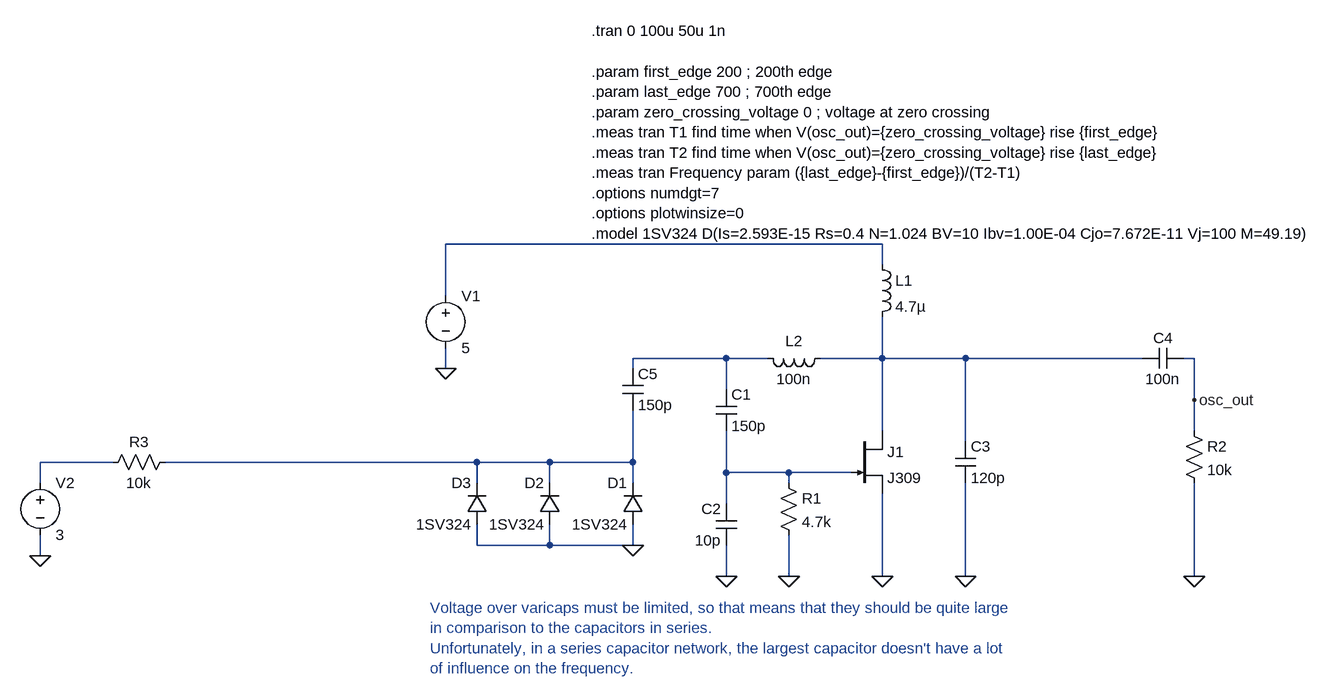
[diagram p0: schematic design5.asc]
design5.asc, the LTspice schematic file:
Version 4
SHEET 1 1480 680
WIRE 704 -32 32 -32
WIRE 704 0 704 -32
WIRE 32 48 32 -32
WIRE 464 144 320 144
WIRE 528 144 464 144
WIRE 704 144 704 80
WIRE 704 144 608 144
WIRE 832 144 704 144
WIRE 1104 144 832 144
WIRE 1184 144 1168 144
WIRE 32 160 32 128
WIRE 320 160 320 144
WIRE 464 192 464 144
WIRE 1184 208 1184 144
WIRE 704 256 704 144
WIRE 1184 256 1184 208
WIRE 832 272 832 144
WIRE -480 304 -592 304
WIRE 80 304 -400 304
WIRE 192 304 80 304
WIRE 320 304 320 224
WIRE 320 304 192 304
WIRE 464 320 464 256
WIRE 560 320 464 320
WIRE 656 320 560 320
WIRE -592 336 -592 304
WIRE 80 336 80 304
WIRE 192 336 192 304
WIRE 320 336 320 304
WIRE 560 336 560 320
WIRE 464 368 464 320
WIRE 80 432 80 400
WIRE 192 432 192 400
WIRE 192 432 80 432
WIRE 320 432 320 400
WIRE 320 432 192 432
WIRE -592 448 -592 416
WIRE 464 480 464 432
WIRE 560 480 560 416
WIRE 704 480 704 352
WIRE 832 480 832 336
WIRE 1184 480 1184 336
FLAG 32 160 0
FLAG 464 480 0
FLAG 704 480 0
FLAG 560 480 0
FLAG 832 480 0
FLAG 1184 480 0
FLAG 1184 208 osc_out
FLAG -592 448 0
FLAG 320 432 0
DATAFLAG 576 320 ""
SYMBOL njf 656 256 R0
SYMATTR InstName J1
SYMATTR Value J309
SYMBOL ind 688 -16 R0
SYMATTR InstName L1
SYMATTR Value 4.7µ
SYMATTR SpiceLine Rser=10
SYMBOL res 544 320 R0
SYMATTR InstName R1
SYMATTR Value 4.7k
SYMBOL cap 448 192 R0
SYMATTR InstName C1
SYMATTR Value 150p
SYMBOL cap 480 432 R180
WINDOW 0 24 56 Left 2
WINDOW 3 24 8 Left 2
SYMATTR InstName C2
SYMATTR Value 10p
SYMBOL ind 624 128 R90
WINDOW 0 5 56 VBottom 2
WINDOW 3 32 56 VTop 2
SYMATTR InstName L2
SYMATTR Value 100n
SYMATTR SpiceLine Rser=0.2
SYMBOL voltage 32 32 R0
WINDOW 123 0 0 Left 0
WINDOW 39 0 0 Left 0
SYMATTR InstName V1
SYMATTR Value 5
SYMBOL cap 816 272 R0
SYMATTR InstName C3
SYMATTR Value 120p
SYMBOL res 1168 240 R0
SYMATTR InstName R2
SYMATTR Value 10k
SYMBOL cap 1168 128 R90
WINDOW 0 0 32 VBottom 2
WINDOW 3 32 32 VTop 2
SYMATTR InstName C4
SYMATTR Value 100n
SYMBOL cap 304 160 R0
SYMATTR InstName C5
SYMATTR Value 150p
SYMBOL res -384 288 R90
WINDOW 0 0 56 VBottom 2
WINDOW 3 32 56 VTop 2
SYMATTR InstName R3
SYMATTR Value 10k
SYMBOL voltage -592 320 R0
WINDOW 123 0 0 Left 0
WINDOW 39 0 0 Left 0
SYMATTR InstName V2
SYMATTR Value 3
SYMBOL diode 336 400 R180
WINDOW 0 24 64 Left 2
WINDOW 3 24 0 Left 2
SYMATTR InstName D1
SYMATTR Value 1SV324
SYMBOL diode 208 400 R180
WINDOW 0 24 64 Left 2
WINDOW 3 24 0 Left 2
SYMATTR InstName D2
SYMATTR Value 1SV324
SYMBOL diode 96 400 R180
WINDOW 0 24 64 Left 2
WINDOW 3 24 0 Left 2
SYMATTR InstName D3
SYMATTR Value 1SV324
TEXT 256 -360 Left 2 !.tran 0 100u 50u 1n\n \n.param first_edge 200 ; 200th edge\n.param last_edge 700 ; 700th edge\n.param zero_crossing_voltage 0 ; voltage at zero crossing\n.meas tran T1 find time when V(osc_out)={zero_crossing_voltage} rise {first_edge}\n.meas tran T2 find time when V(osc_out)={zero_crossing_voltage} rise {last_edge}\n.meas tran Frequency param ({last_edge}-{first_edge})/(T2-T1)\n.options numdgt=7\n.options plotwinsize=0\n.model 1SV324 D(Is=2.593E-15 Rs=0.4 N=1.024 BV=10 Ibv=1.00E-04 Cjo=7.672E-11 Vj=100 M=49.19)
TEXT 8 528 Left 2 ;Voltage over varicaps must be limited, so that means that they should be quite large\nin comparison to the capacitors in series.\nUnfortunately, in a series capacitor network, the largest capacitor doesn't have a lot \nof influence on the frequency.

The netlist it stands for:
* design5.asc
J1 N003 N006 0 J309
L1 N001 N003 4.7µ Rser=10
R1 N006 0 4.7k
C1 N002 N006 150p
C2 0 N006 10p
L2 N003 N002 100n Rser=0.2
V1 N001 0 5
C3 N003 0 120p
R2 osc_out 0 10k
C4 osc_out N003 100n
C5 N002 N005 150p
R3 N005 N004 10k
V2 N004 0 3
D1 0 N005 1SV324
D2 0 N005 1SV324
D3 0 N005 1SV324
.model D D
.lib standard.dio
.model NJF NJF
.model PJF PJF
.lib standard.jft
.tran 0 100u 50u 1n
.param first_edge 200 ; 200th edge
.param last_edge 700 ; 700th edge
.param zero_crossing_voltage 0 ; voltage at zero crossing
.meas tran T1 find time when V(osc_out)={zero_crossing_voltage} rise {first_edge}
.meas tran T2 find time when V(osc_out)={zero_crossing_voltage} rise {last_edge}
.meas tran Frequency param ({last_edge}-{first_edge})/(T2-T1)
.options numdgt=7
.options plotwinsize=0
.model 1SV324 D(Is=2.593E-15 Rs=0.4 N=1.024 BV=10 Ibv=1.00E-04 Cjo=7.672E-11 Vj=100 M=49.19)
* Voltage over varicaps must be limited, so that means that they should be quite large
* in comparison to the capacitors in series.
* Unfortunately, in a series capacitor network, the largest capacitor doesn't have a lot
* of influence on the frequency.
.backanno
.end